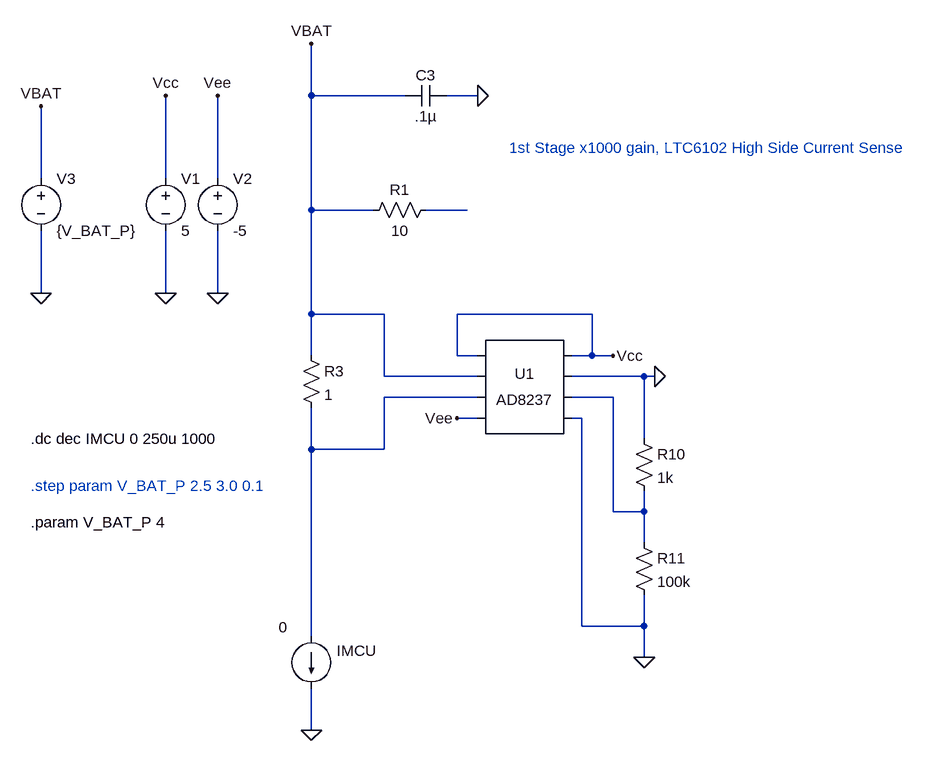
[diagram p0: schematic cm_ad8237_tlv272_A.asc]
cm_ad8237_tlv272_A.asc, the LTspice schematic file:
Version 4
SHEET 1 2532 980
WIRE -144 -528 -144 -608
WIRE 0 -528 -144 -528
WIRE 112 -528 64 -528
WIRE -560 -400 -560 -512
WIRE -368 -400 -368 -528
WIRE -288 -400 -288 -528
WIRE -144 -352 -144 -528
WIRE -48 -352 -144 -352
WIRE 96 -352 32 -352
WIRE -560 -224 -560 -320
WIRE -368 -224 -368 -320
WIRE -288 -224 -288 -320
WIRE -144 -192 -144 -352
WIRE -32 -192 -144 -192
WIRE 288 -192 80 -192
WIRE -144 -128 -144 -192
WIRE 80 -128 80 -192
WIRE 112 -128 80 -128
WIRE 288 -128 288 -192
WIRE 288 -128 256 -128
WIRE 320 -128 288 -128
WIRE -32 -96 -32 -192
WIRE 112 -96 -32 -96
WIRE 368 -96 256 -96
WIRE 384 -96 368 -96
WIRE 112 -64 -32 -64
WIRE 320 -64 256 -64
WIRE 112 -32 80 -32
WIRE 272 -32 256 -32
WIRE 368 0 368 -96
WIRE -144 16 -144 -48
WIRE -32 16 -32 -64
WIRE -32 16 -144 16
WIRE 320 112 320 -64
WIRE 368 112 368 80
WIRE 368 112 320 112
WIRE 368 160 368 112
WIRE 272 288 272 -32
WIRE 368 288 368 240
WIRE 368 288 272 288
WIRE -144 304 -144 16
WIRE 368 336 368 288
WIRE -144 448 -144 384
FLAG -368 -224 0
FLAG -368 -528 Vcc
FLAG 112 -528 0
FLAG -560 -224 0
FLAG -560 -512 VBAT
FLAG -144 -608 VBAT
FLAG -144 448 0
FLAG 320 -128 Vcc
FLAG -288 -224 0
FLAG -288 -528 Vee
FLAG 368 336 0
FLAG 80 -32 Vee
FLAG 384 -96 0
SYMBOL voltage -368 -416 R0
WINDOW 123 0 0 Left 2
WINDOW 39 0 0 Left 2
SYMATTR InstName V1
SYMATTR Value 5
SYMBOL cap 0 -512 R270
WINDOW 0 32 32 VTop 2
WINDOW 3 0 32 VBottom 2
SYMATTR InstName C3
SYMATTR Value .1µ
SYMBOL voltage -560 -416 R0
WINDOW 123 0 0 Left 2
WINDOW 39 0 0 Left 2
SYMATTR InstName V3
SYMATTR Value {V_BAT_P}
SYMBOL res -160 -144 R0
SYMATTR InstName R3
SYMATTR Value 1
SYMATTR SpiceLine tol=0.01 pwr=100m
SYMBOL current -144 304 R0
WINDOW 123 47 58 Left 2
WINDOW 39 0 0 Left 2
WINDOW 3 -50 -14 Left 2
WINDOW 0 39 22 Left 2
SYMATTR Value 0
SYMATTR InstName IMCU
SYMBOL res 48 -368 R90
WINDOW 0 0 56 VBottom 2
WINDOW 3 32 56 VTop 2
SYMATTR InstName R1
SYMATTR Value 10
SYMATTR SpiceLine tol=.1
SYMBOL AutoGenerated\\AD8237 176 -80 R0
SYMATTR InstName U1
SYMBOL voltage -288 -416 R0
WINDOW 123 0 0 Left 2
WINDOW 39 0 0 Left 2
SYMATTR InstName V2
SYMATTR Value -5
SYMBOL res 352 -16 R0
SYMATTR InstName R10
SYMATTR Value 1k
SYMBOL res 352 144 R0
SYMATTR InstName R11
SYMATTR Value 100k
TEXT -576 72 Left 2 ;.step param V_BAT_P 2.5 3.0 0.1
TEXT -576 128 Left 2 !.param V_BAT_P 4
TEXT -576 0 Left 2 !.dc dec IMCU 0 250u 1000
TEXT 160 -448 Left 2 ;1st Stage x1000 gain, LTC6102 High Side Current Sense

The netlist it stands for:
* cm_ad8237_tlv272_A.asc
V1 Vcc 0 5
C3 VBAT 0 .1µ
V3 VBAT 0 {V_BAT_P}
R3 VBAT N002 1 tol=0.01 pwr=100m
IMCU N002 0 0
R1 N001 VBAT 10 tol=.1
* U1: AD8237 (symbol AutoGenerated\AD8237 not available, pins judged from their places): pin1=Vcc pin2=VBAT pin3=N002 pin4=Vee pin5=Vcc pin6=0 pin7=N003 pin8=0
V2 Vee 0 -5
R10 0 N003 1k
R11 N003 0 100k
* .step param V_BAT_P 2.5 3.0 0.1
.param V_BAT_P 4
.dc dec IMCU 0 250u 1000
* 1st Stage x1000 gain, LTC6102 High Side Current Sense
.backanno
.end